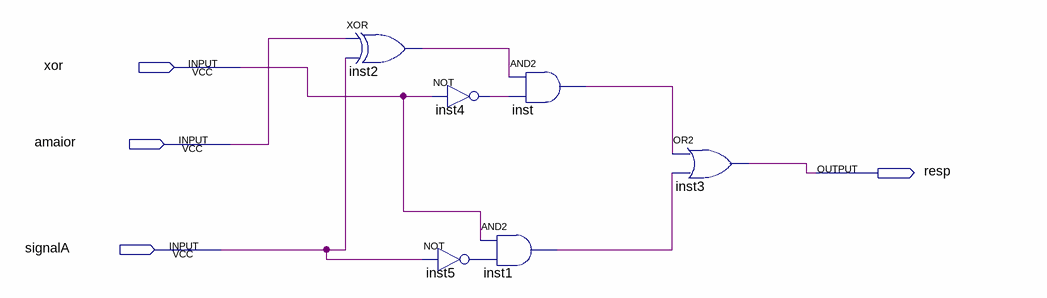
[diagram p0: schematic sheet]
// Quartus schematic signal.bdf as structural Verilog: 6 symbols, 4 pins
module signal (
  input  \xor ,
  input  amaior,
  input  signalA,
  output resp
);

  wire inst1_out, inst2_out, inst4_out, inst5_out, inst_out;

  xor inst2 (inst2_out, amaior, signalA);
  not inst4 (inst4_out, \xor );
  and inst1 (inst1_out, \xor , inst5_out);
  not inst5 (inst5_out, signalA);
  and inst (inst_out, inst2_out, inst4_out);
  or inst3 (resp, inst_out, inst1_out);
endmodule
